# Altium schematic sheet 0056_DISPLAY - EDP MUX .SchDoc (part 1 of 2)
size 848 x 558 mm
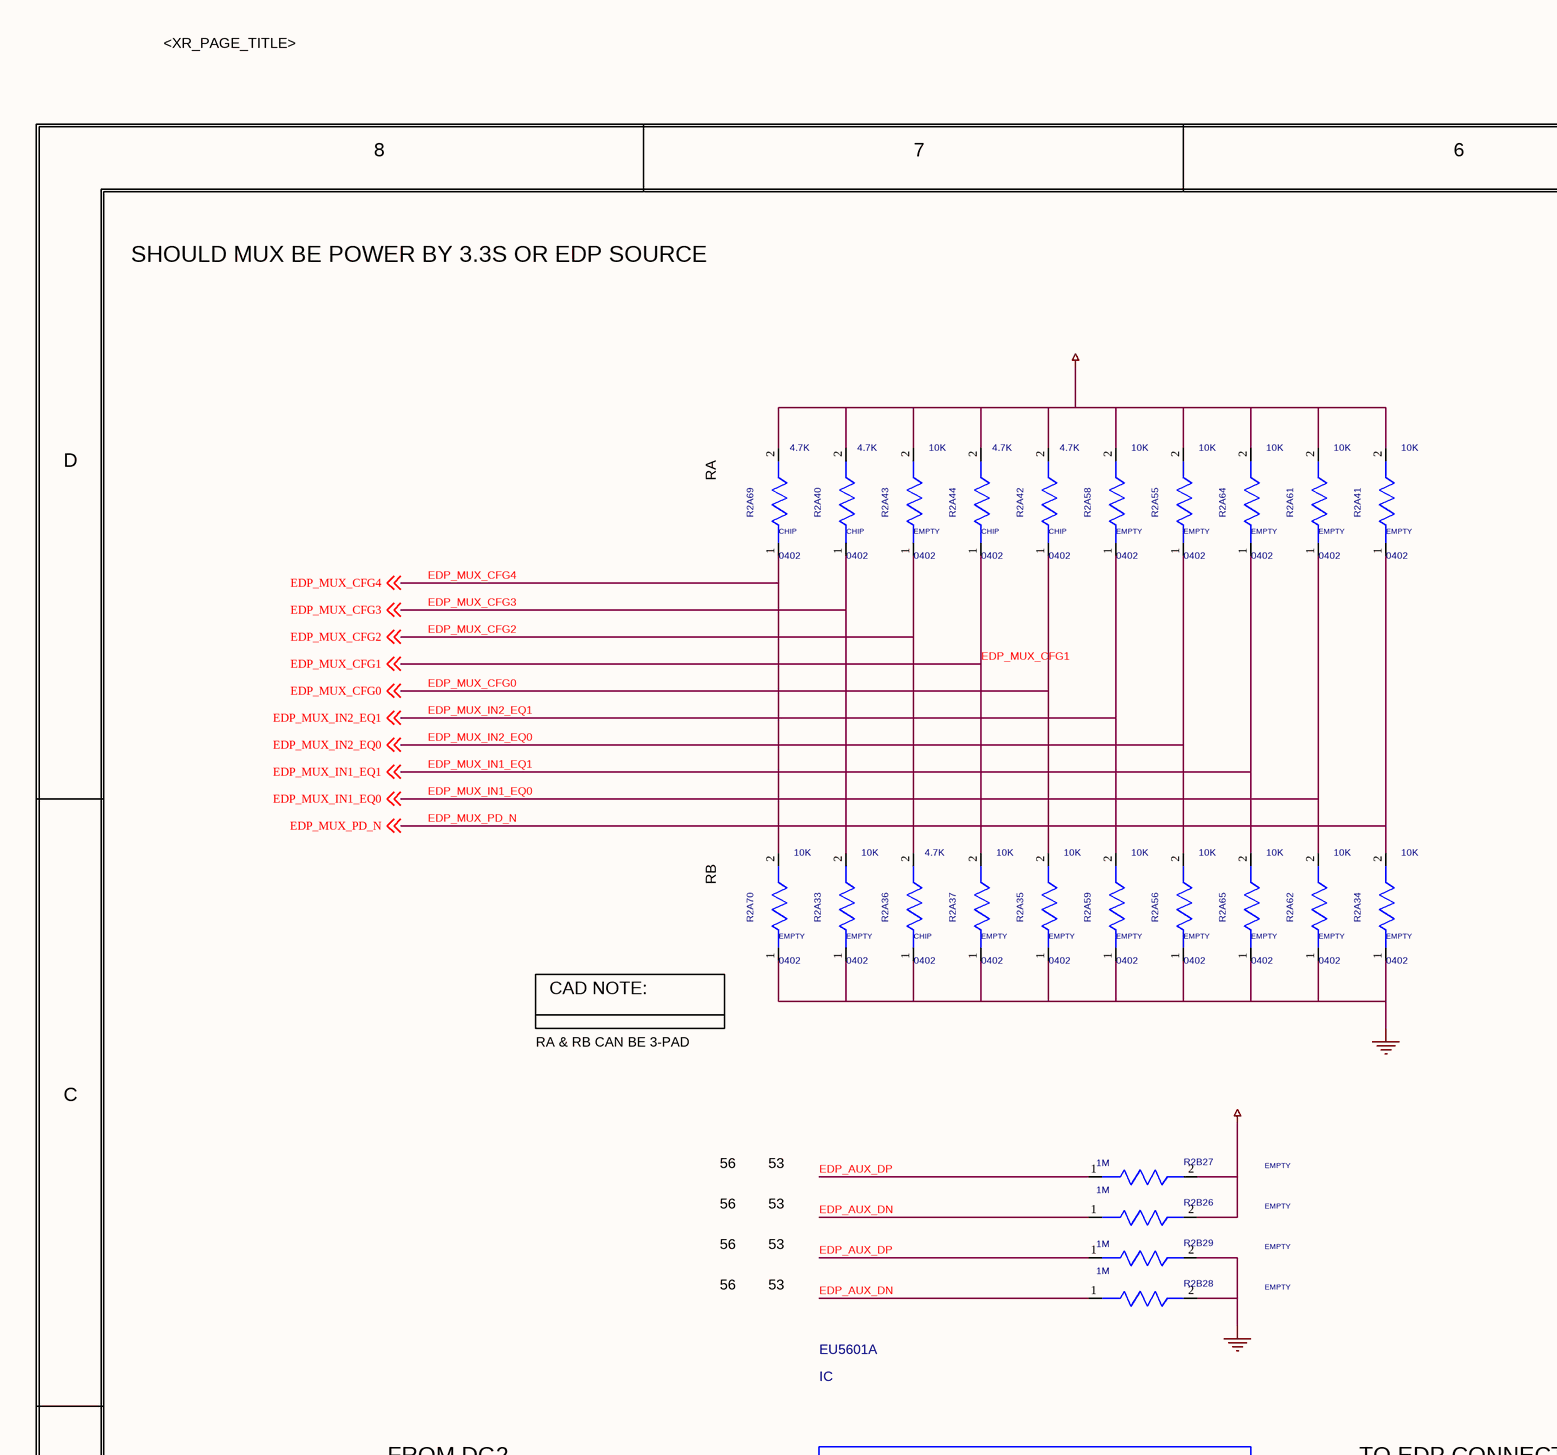
[diagram p0: 0056_DISPLAY - EDP MUX .SchDoc, top left]
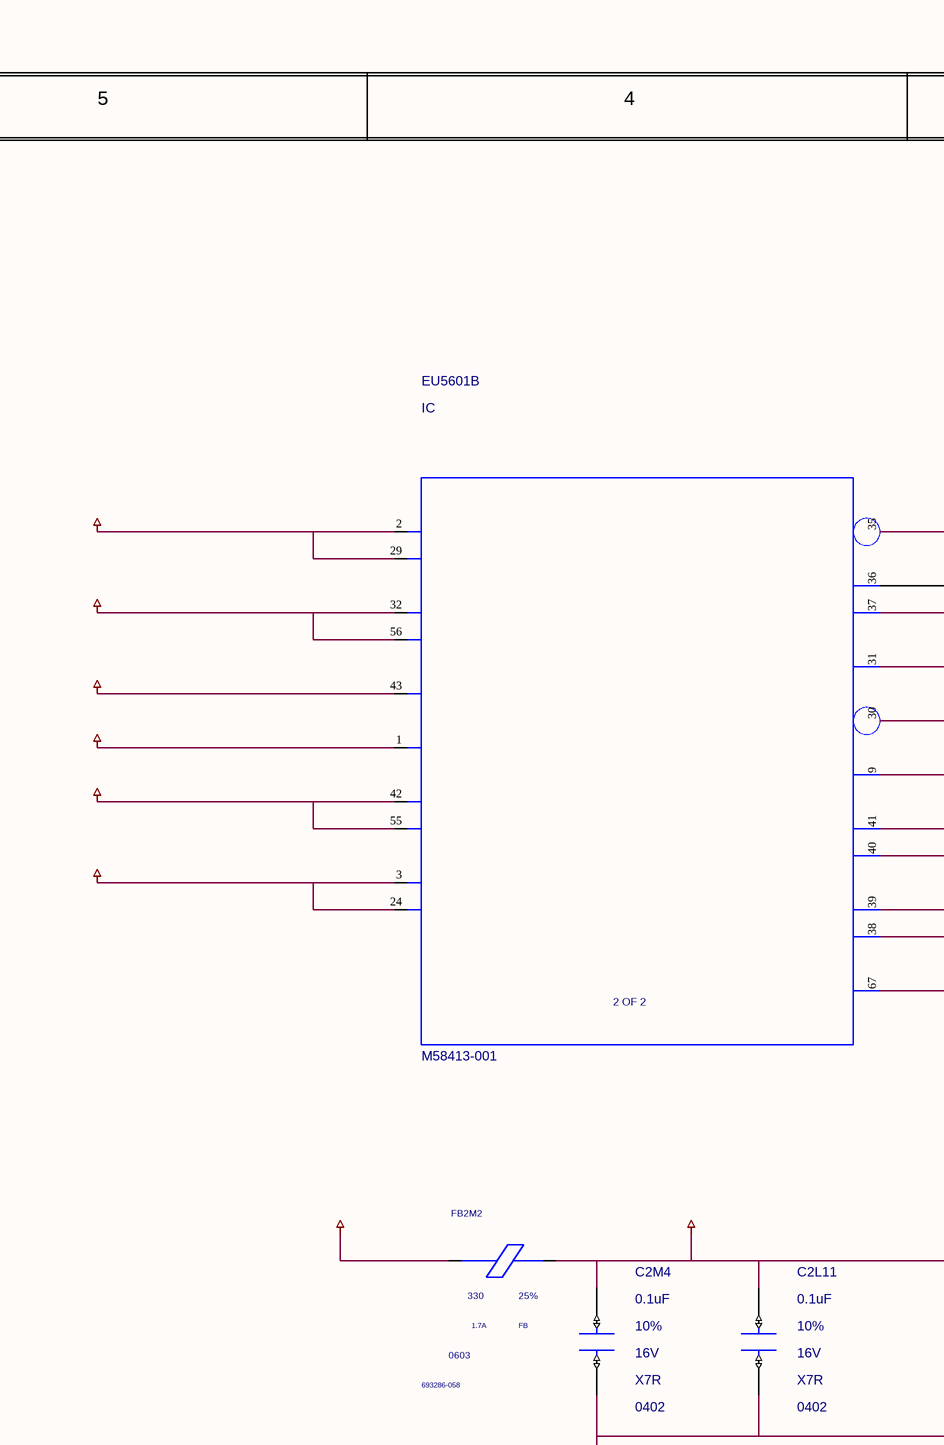
[diagram p1: 0056_DISPLAY - EDP MUX .SchDoc, top middle]
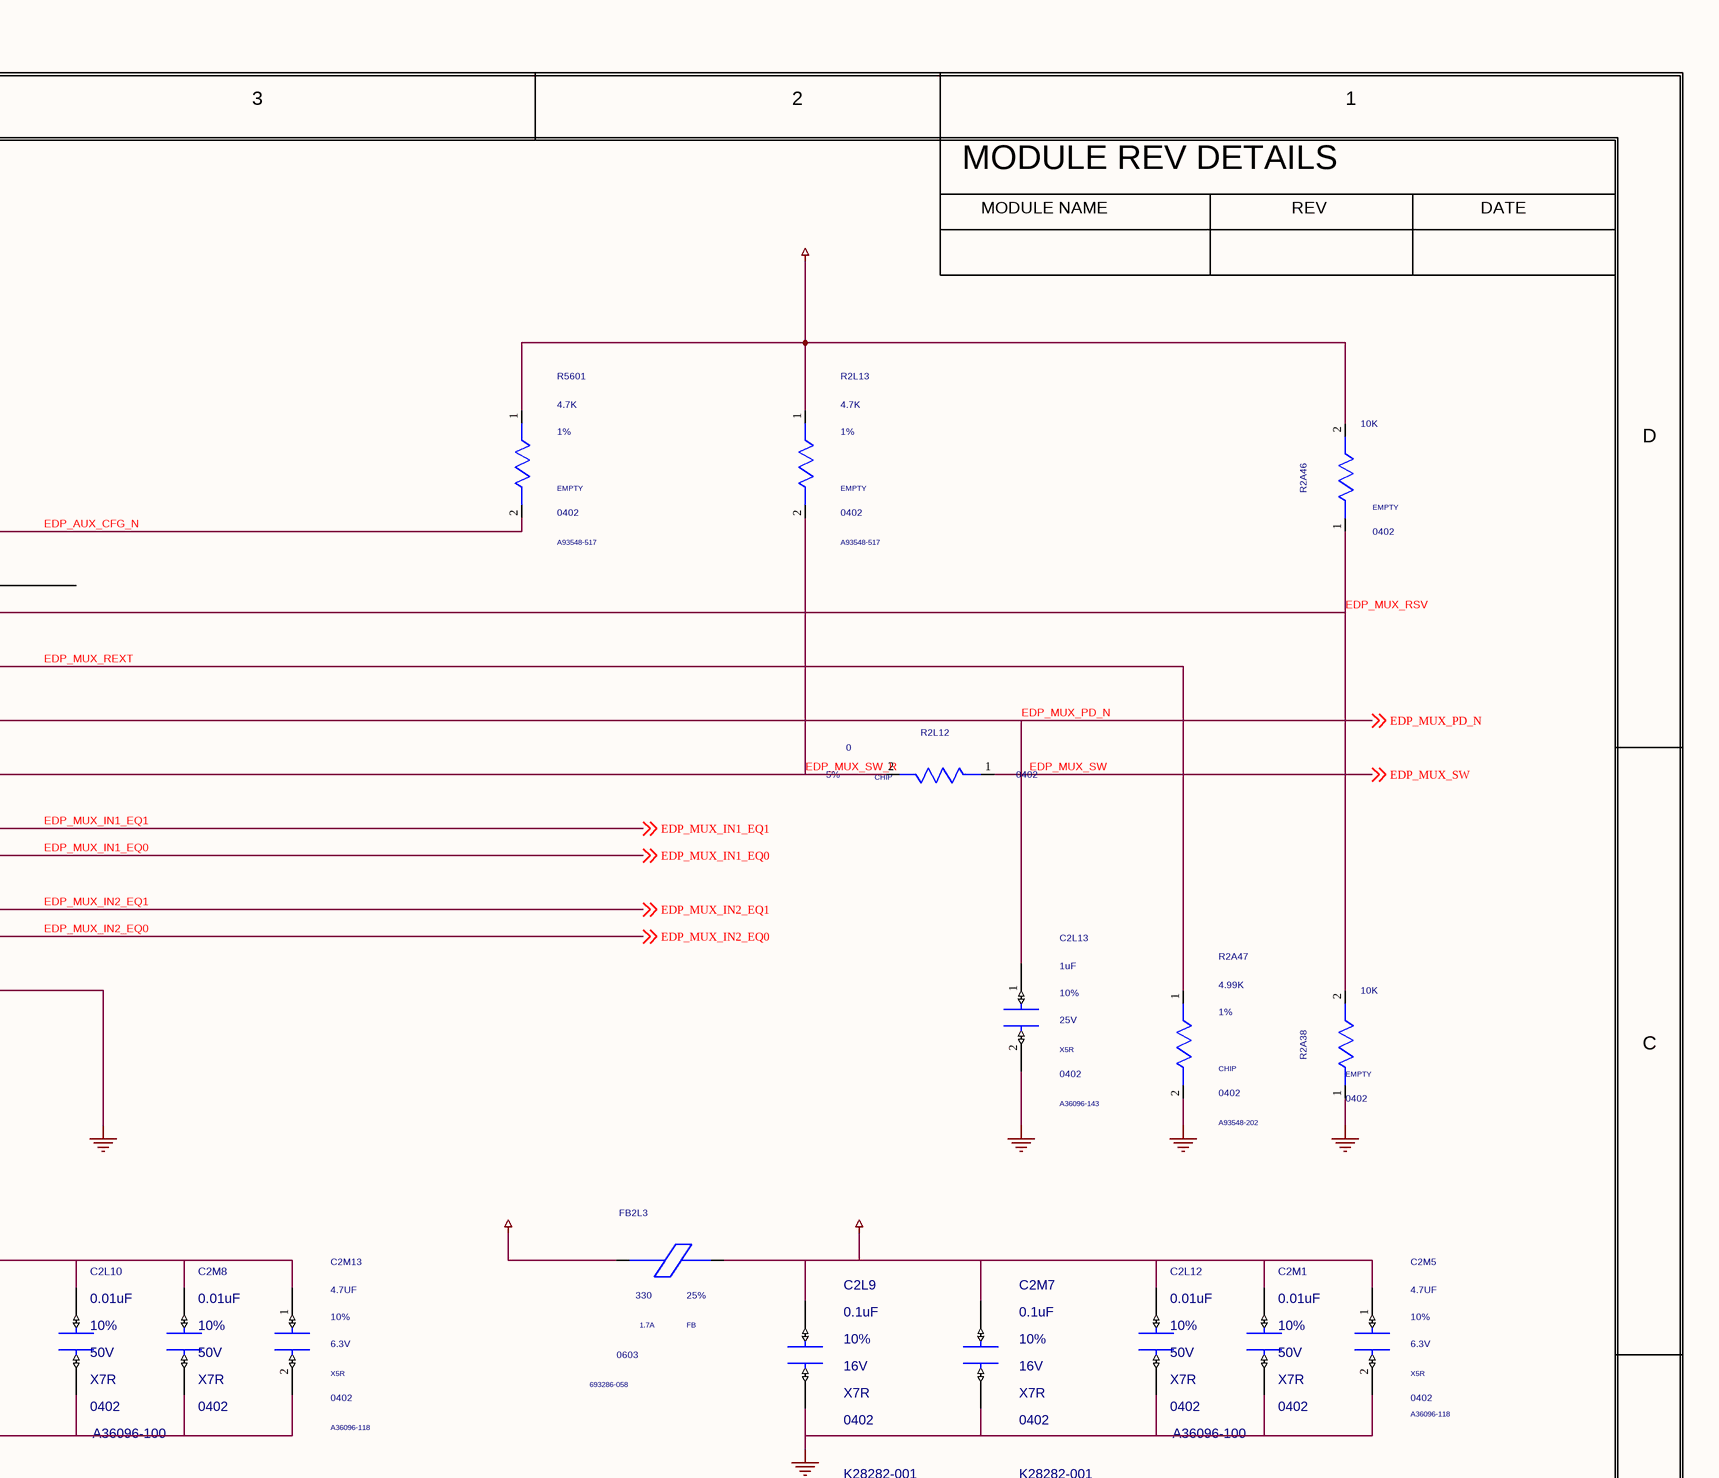
[diagram p2: 0056_DISPLAY - EDP MUX .SchDoc, top right]
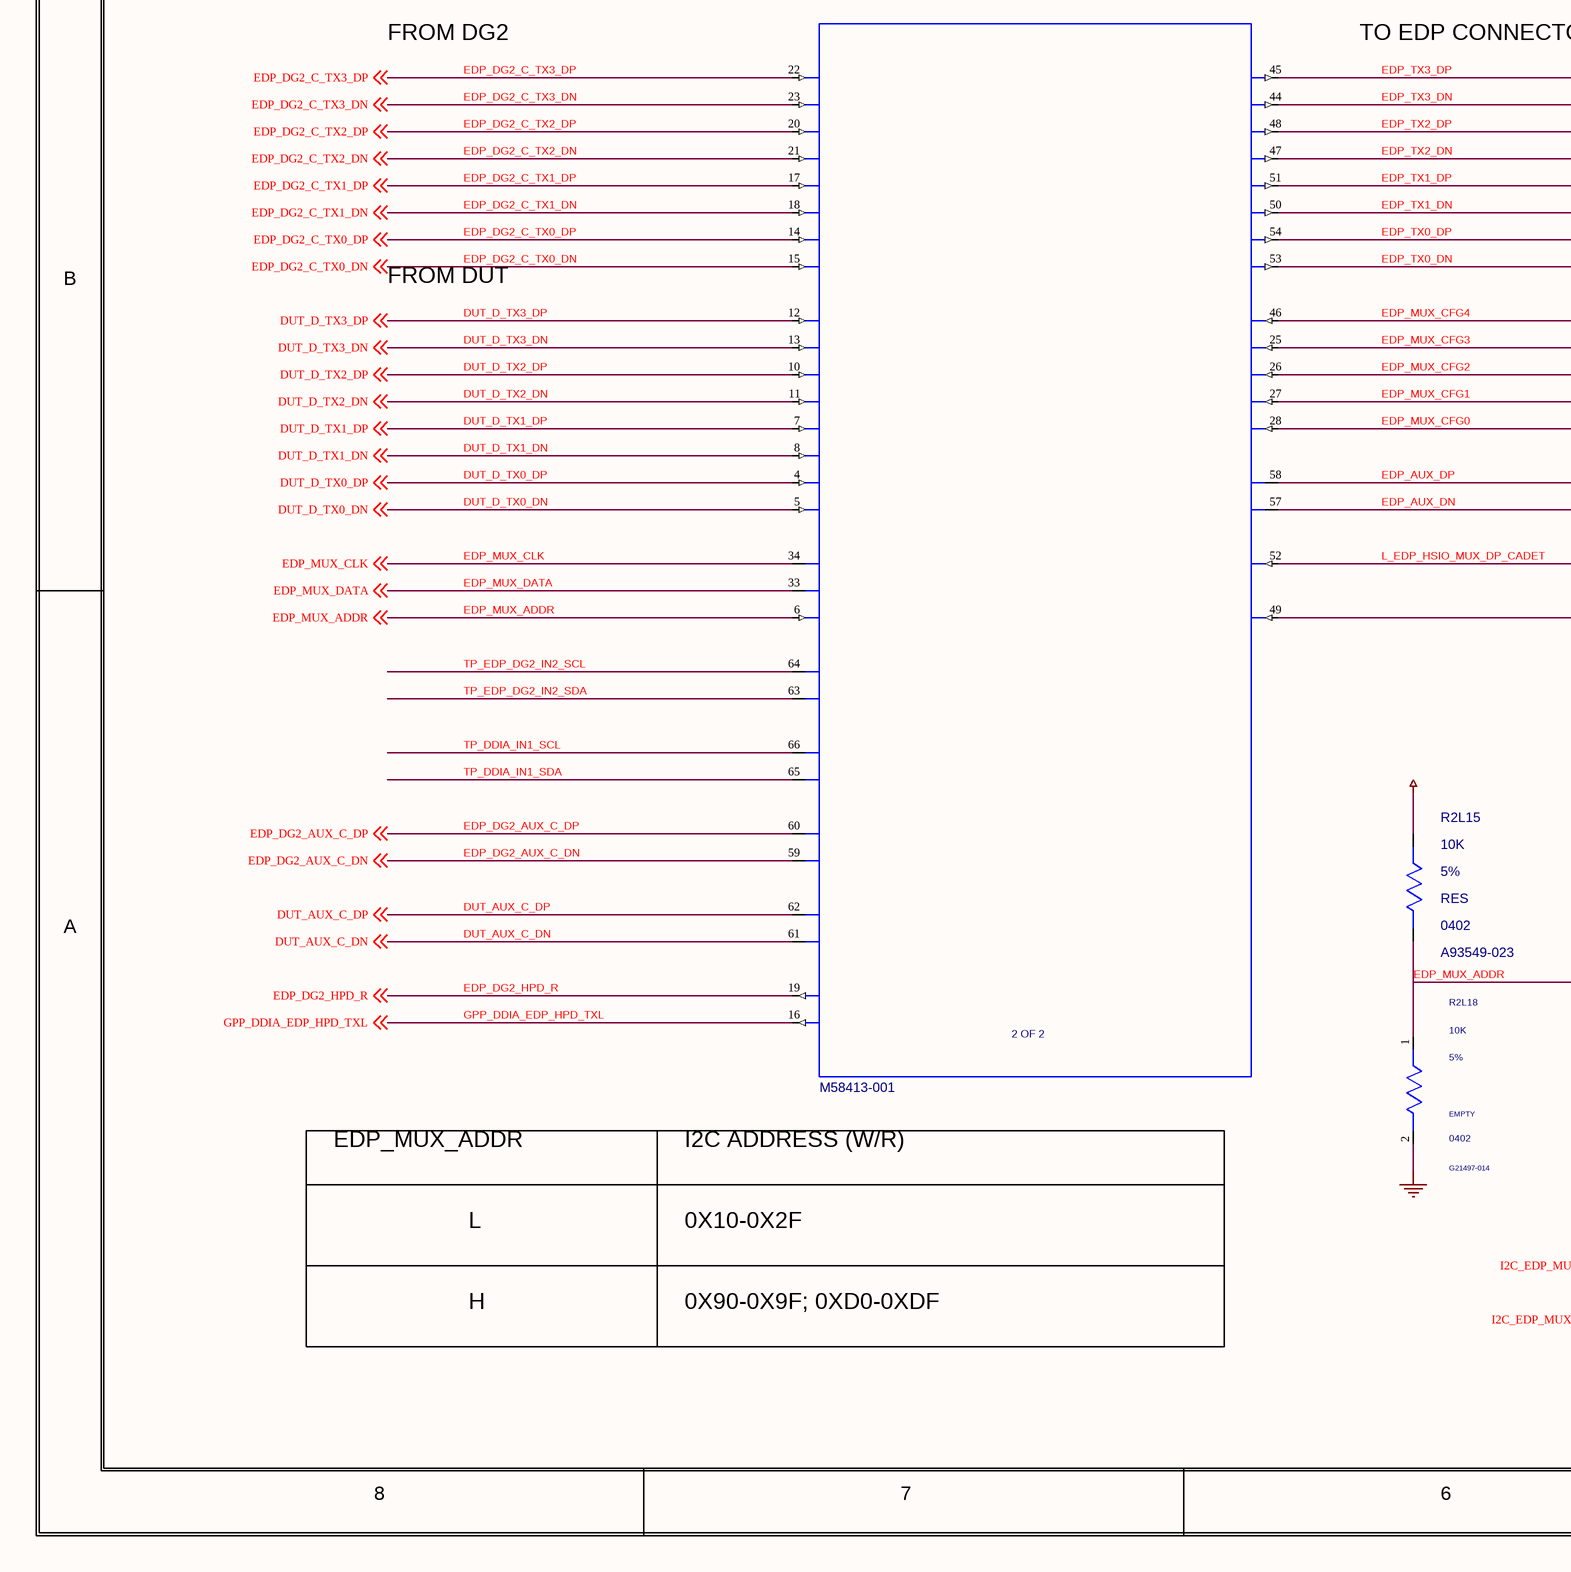
[diagram p3: 0056_DISPLAY - EDP MUX .SchDoc, bottom left]
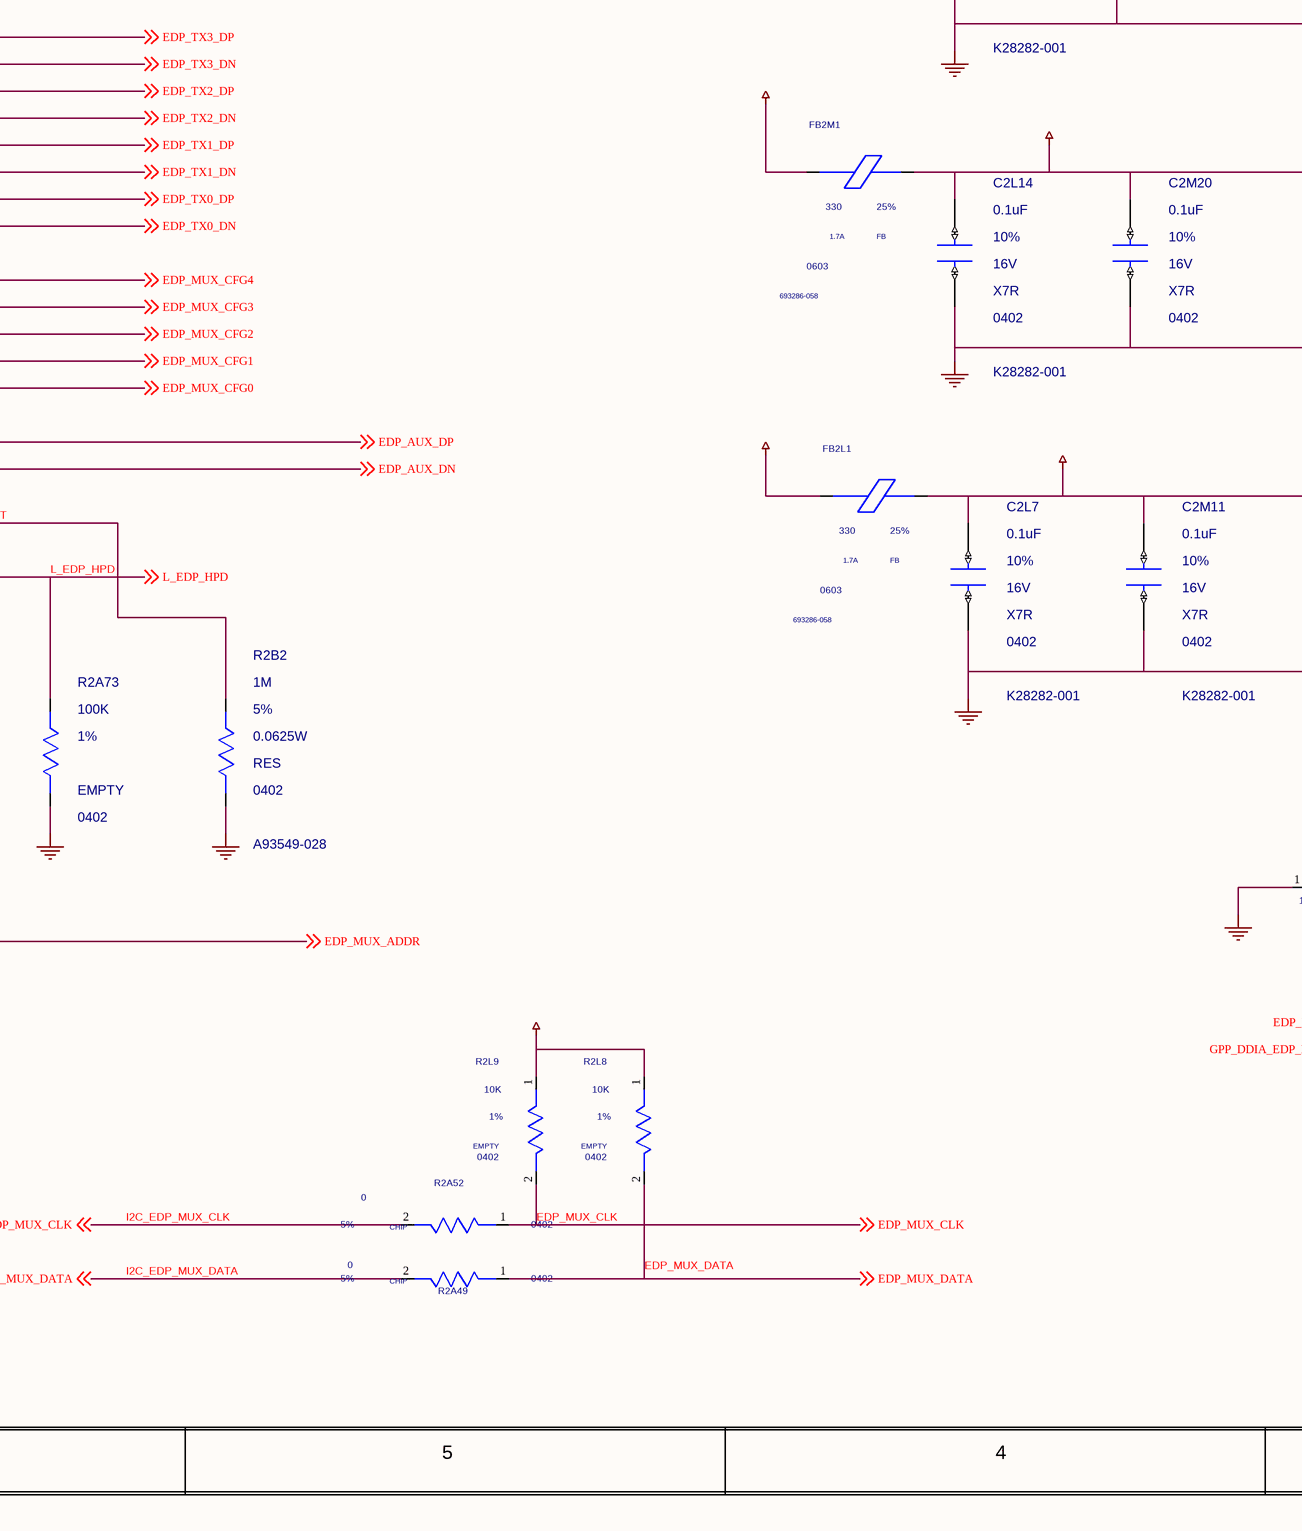
[diagram p4: 0056_DISPLAY - EDP MUX .SchDoc, bottom middle]
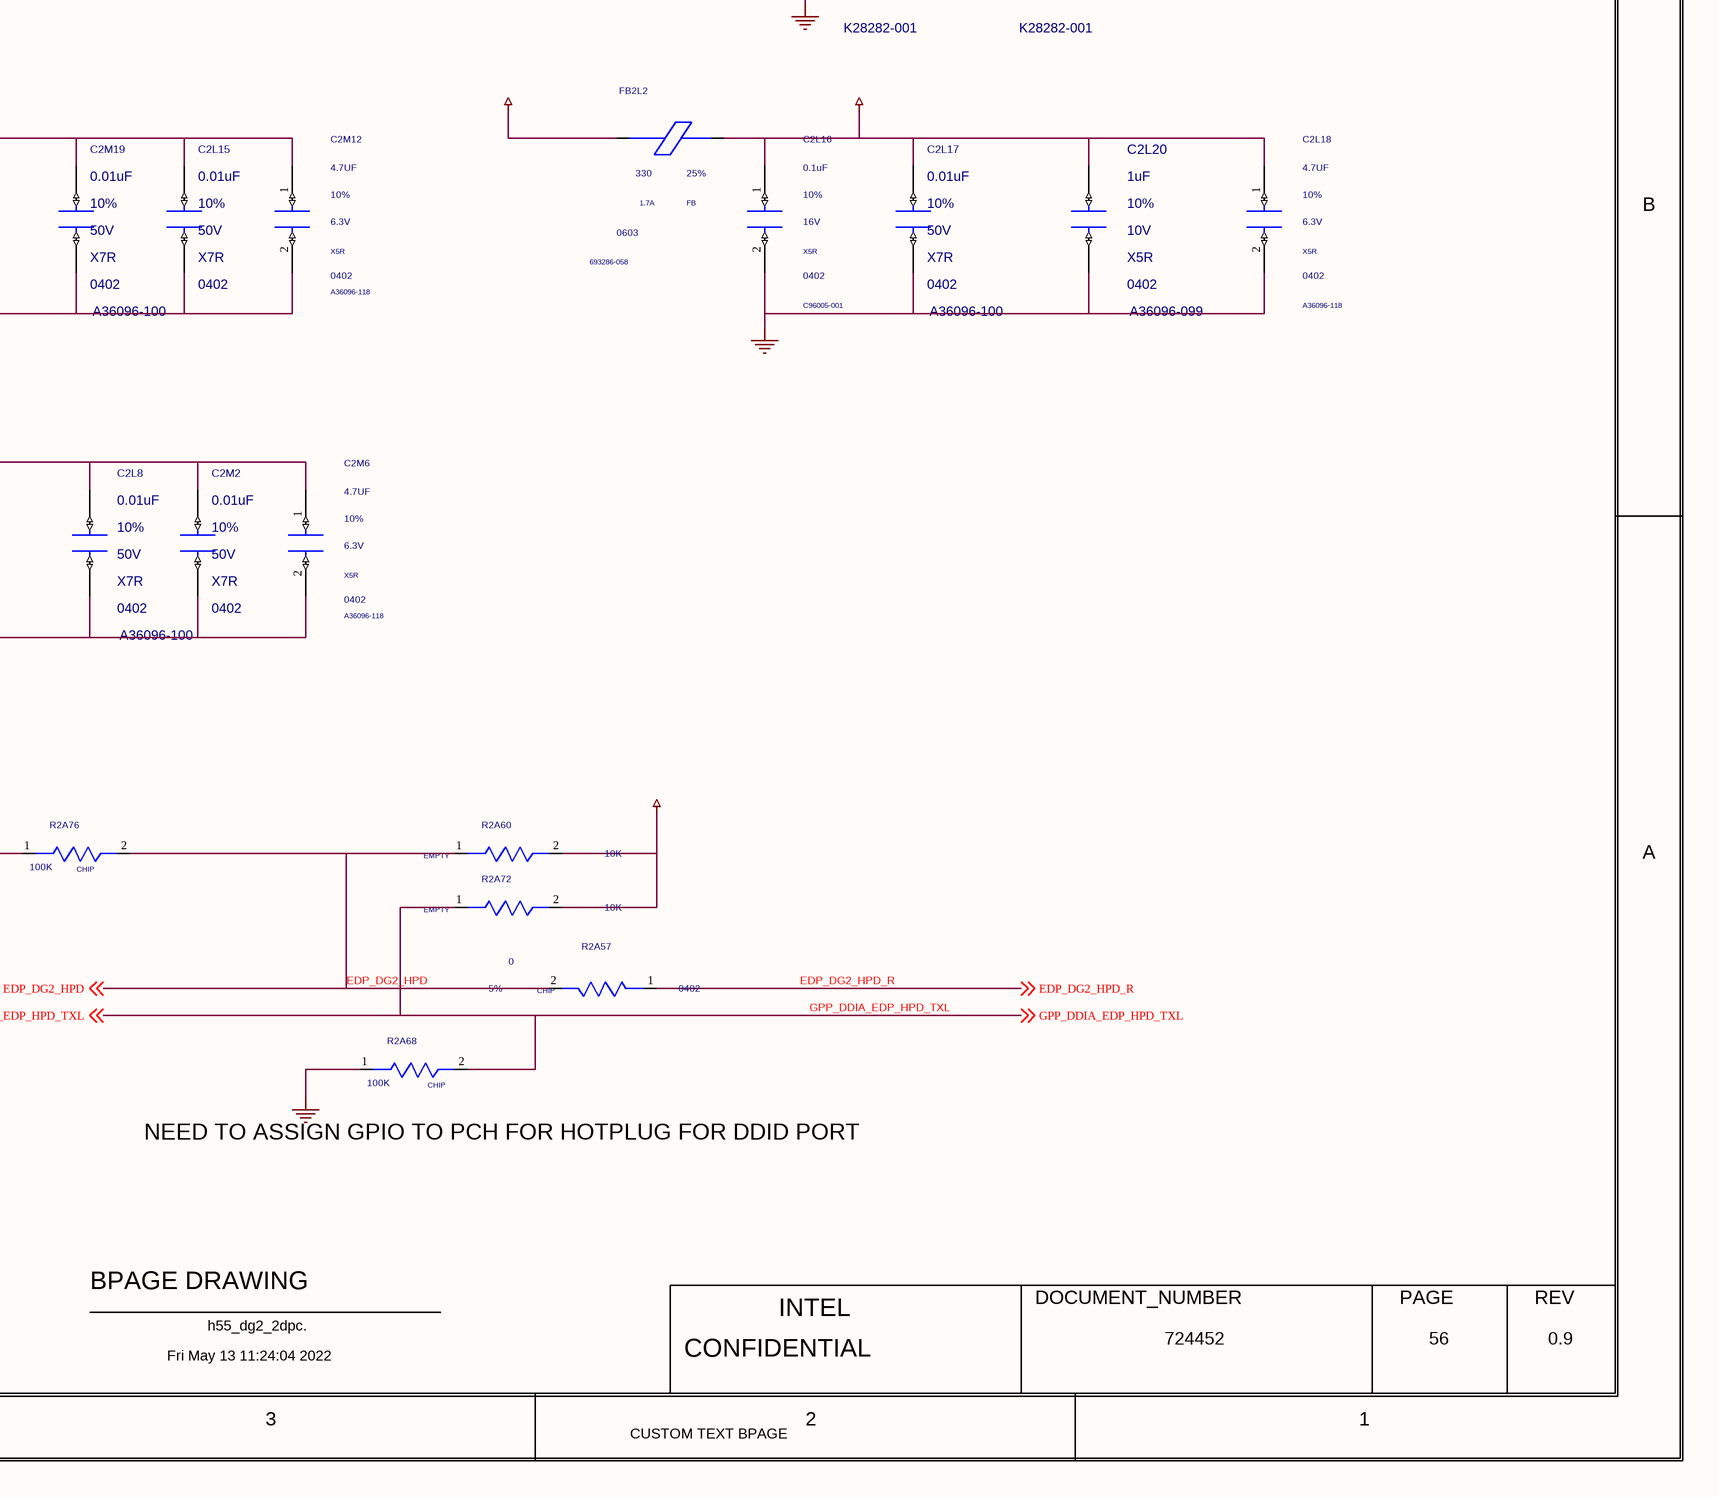
[diagram p5: 0056_DISPLAY - EDP MUX .SchDoc, bottom right]

## Parts
C2L7  0.1uF  MATERIAL: X7R  PACK_TYPE: 0402  PART_NUMBER: K28282-001  TOLERANCE: 10%  VOLTAGE: 16V  [CTK2_SM0402_1050X550_MA]
C2L8  0.01uF  MATERIAL: X7R  PACK_TYPE: 0402  PART_NUMBER: A36096-100  TOLERANCE: 10%  VOLTAGE: 50V  [CTK2_SM0402_1050X550_MA]
C2L9  0.1uF  MATERIAL: X7R  PACK_TYPE: 0402  PART_NUMBER: K28282-001  TOLERANCE: 10%  VOLTAGE: 16V  [CTK2_SM0402_1050X550_MA]
C2L10  0.01uF  MATERIAL: X7R  PACK_TYPE: 0402  PART_NUMBER: A36096-100  TOLERANCE: 10%  VOLTAGE: 50V  [CTK2_SM0402_1050X550_MA]
C2L11  0.1uF  MATERIAL: X7R  PACK_TYPE: 0402  TOLERANCE: 10%  VOLTAGE: 16V  [CTK2_SM0402_1050X550_MA]
C2L12  0.01uF  MATERIAL: X7R  PACK_TYPE: 0402  PART_NUMBER: A36096-100  TOLERANCE: 10%  VOLTAGE: 50V  [CTK2_SM0402_1050X550_MA]
C2L13  1uF  MATERIAL: X5R  PACK_TYPE: 0402  PART_NUMBER: A36096-143  TOLERANCE: 10%  VOLTAGE: 25V  [SMC0402MA]
C2L14  0.1uF  MATERIAL: X7R  PACK_TYPE: 0402  PART_NUMBER: K28282-001  TOLERANCE: 10%  VOLTAGE: 16V  [CTK2_SM0402_1050X550_MA]
C2L15  0.01uF  MATERIAL: X7R  PACK_TYPE: 0402  TOLERANCE: 10%  VOLTAGE: 50V  [CTK2_SM0402_1050X550_MA]
C2L16  0.1uF  MATERIAL: X5R  PACK_TYPE: 0402  PART_NUMBER: C96005-001  TOLERANCE: 10%  VOLTAGE: 16V  [SMC0402IE]
C2L17  0.01uF  MATERIAL: X7R  PACK_TYPE: 0402  PART_NUMBER: A36096-100  TOLERANCE: 10%  VOLTAGE: 50V  [CTK2_SM0402_1050X550_MA]
C2L18  4.7UF  MATERIAL: X5R  PACK_TYPE: 0402  PART_NUMBER: A36096-118  TOLERANCE: 10%  VOLTAGE: 6.3V  [SMC0402MA]
C2L20  1uF  MATERIAL: X5R  PACK_TYPE: 0402  PART_NUMBER: A36096-099  TOLERANCE: 10%  VOLTAGE: 10V  [CTK2_SM0402_1050X550_MA]
C2M1  0.01uF  MATERIAL: X7R  PACK_TYPE: 0402  TOLERANCE: 10%  VOLTAGE: 50V  [CTK2_SM0402_1050X550_MA]
C2M2  0.01uF  MATERIAL: X7R  PACK_TYPE: 0402  TOLERANCE: 10%  VOLTAGE: 50V  [CTK2_SM0402_1050X550_MA]
C2M4  0.1uF  MATERIAL: X7R  PACK_TYPE: 0402  PART_NUMBER: K28282-001  TOLERANCE: 10%  VOLTAGE: 16V  [CTK2_SM0402_1050X550_MA]
C2M5  4.7UF  MATERIAL: X5R  PACK_TYPE: 0402  PART_NUMBER: A36096-118  TOLERANCE: 10%  VOLTAGE: 6.3V  [SMC0402MA]
C2M6  4.7UF  MATERIAL: X5R  PACK_TYPE: 0402  PART_NUMBER: A36096-118  TOLERANCE: 10%  VOLTAGE: 6.3V  [SMC0402MA]
C2M7  0.1uF  MATERIAL: X7R  PACK_TYPE: 0402  PART_NUMBER: K28282-001  TOLERANCE: 10%  VOLTAGE: 16V  [CTK2_SM0402_1050X550_MA]
C2M8  0.01uF  MATERIAL: X7R  PACK_TYPE: 0402  TOLERANCE: 10%  VOLTAGE: 50V  [CTK2_SM0402_1050X550_MA]
C2M11  0.1uF  MATERIAL: X7R  PACK_TYPE: 0402  PART_NUMBER: K28282-001  TOLERANCE: 10%  VOLTAGE: 16V  [CTK2_SM0402_1050X550_MA]
C2M12  4.7UF  MATERIAL: X5R  PACK_TYPE: 0402  PART_NUMBER: A36096-118  TOLERANCE: 10%  VOLTAGE: 6.3V  [SMC0402MA]
C2M13  4.7UF  MATERIAL: X5R  PACK_TYPE: 0402  PART_NUMBER: A36096-118  TOLERANCE: 10%  VOLTAGE: 6.3V  [SMC0402MA]
C2M19  0.01uF  MATERIAL: X7R  PACK_TYPE: 0402  PART_NUMBER: A36096-100  TOLERANCE: 10%  VOLTAGE: 50V  [CTK2_SM0402_1050X550_MA]
C2M20  0.1uF  MATERIAL: X7R  PACK_TYPE: 0402  TOLERANCE: 10%  VOLTAGE: 16V  [CTK2_SM0402_1050X550_MA]
EU5601  MATERIAL: IC  PART_NUMBER: M58413-001  PART_SYM_NUM: 2 OF 2  [CTK2_LCC66_5000X10000_400_DF3600X8600_MA]  (hidden comment: C_PS8461E_A)  (parts A,B of 2)
FB2L1  330  CURRENT: 1.7A  MATERIAL: FB  PACK_TYPE: 0603  PART_NUMBER: 693286-058  TOLERANCE: 25%  [CTK2_SM0603_1750X950_MA]
FB2L2  330  CURRENT: 1.7A  MATERIAL: FB  PACK_TYPE: 0603  PART_NUMBER: 693286-058  TOLERANCE: 25%  [CTK2_SM0603_1750X950_MA]
FB2L3  330  CURRENT: 1.7A  MATERIAL: FB  PACK_TYPE: 0603  PART_NUMBER: 693286-058  TOLERANCE: 25%  [CTK2_SM0603_1750X950_MA]
FB2M1  330  CURRENT: 1.7A  MATERIAL: FB  PACK_TYPE: 0603  PART_NUMBER: 693286-058  TOLERANCE: 25%  [CTK2_SM0603_1750X950_MA]
FB2M2  330  CURRENT: 1.7A  MATERIAL: FB  PACK_TYPE: 0603  PART_NUMBER: 693286-058  TOLERANCE: 25%  [CTK2_SM0603_1750X950_MA]
R2A33  10K  MATERIAL: EMPTY  PACK_TYPE: 0402  [SMR0402IA]
R2A34  10K  MATERIAL: EMPTY  PACK_TYPE: 0402  [SMR0402IA]
R2A35  10K  MATERIAL: EMPTY  PACK_TYPE: 0402  [SMR0402IA]
R2A36  4.7K  MATERIAL: CHIP  PACK_TYPE: 0402  [SMR0402IA]
R2A37  10K  MATERIAL: EMPTY  PACK_TYPE: 0402  [SMR0402IA]
R2A38  10K  MATERIAL: EMPTY  PACK_TYPE: 0402  [SMR0402IA]
R2A40  4.7K  MATERIAL: CHIP  PACK_TYPE: 0402  [SMR0402IA]
R2A41  10K  MATERIAL: EMPTY  PACK_TYPE: 0402  [SMR0402IA]
R2A42  4.7K  MATERIAL: CHIP  PACK_TYPE: 0402  [SMR0402IA]
R2A43  10K  MATERIAL: EMPTY  PACK_TYPE: 0402  [SMR0402IA]
R2A44  4.7K  MATERIAL: CHIP  PACK_TYPE: 0402  [SMR0402IA]
R2A46  10K  MATERIAL: EMPTY  PACK_TYPE: 0402  [SMR0402IA]
R2A47  4.99K  MATERIAL: CHIP  PACK_TYPE: 0402  PART_NUMBER: A93548-202  TOLERANCE: 1%  [SMR0402IA]
R2A49  0  MATERIAL: CHIP  PACK_TYPE: 0402  TOLERANCE: 5%  [SMR0402IA]
R2A52  0  MATERIAL: CHIP  PACK_TYPE: 0402  TOLERANCE: 5%  [SMR0402IA]
R2A55  10K  MATERIAL: EMPTY  PACK_TYPE: 0402  [SMR0402IA]
R2A56  10K  MATERIAL: EMPTY  PACK_TYPE: 0402  [SMR0402IA]
R2A57  0  MATERIAL: CHIP  PACK_TYPE: 0402  TOLERANCE: 5%  [SMR0402IA]
R2A58  10K  MATERIAL: EMPTY  PACK_TYPE: 0402  [SMR0402IA]
R2A59  10K  MATERIAL: EMPTY  PACK_TYPE: 0402  [SMR0402IA]
R2A60  10K  MATERIAL: EMPTY  [SMR0402IA]
R2A61  10K  MATERIAL: EMPTY  PACK_TYPE: 0402  [SMR0402IA]
R2A62  10K  MATERIAL: EMPTY  PACK_TYPE: 0402  [SMR0402IA]
R2A64  10K  MATERIAL: EMPTY  PACK_TYPE: 0402  [SMR0402IA]
R2A65  10K  MATERIAL: EMPTY  PACK_TYPE: 0402  [SMR0402IA]
R2A68  100K  MATERIAL: CHIP  [SMR0402IA]
R2A69  4.7K  MATERIAL: CHIP  PACK_TYPE: 0402  [SMR0402IA]
R2A70  10K  MATERIAL: EMPTY  PACK_TYPE: 0402  [SMR0402IA]
R2A72  10K  MATERIAL: EMPTY  [SMR0402IA]
R2A73  100K  MATERIAL: EMPTY  PACK_TYPE: 0402  TOLERANCE: 1%  [CTK2_SM0402_1100X550_MA]
R2A76  100K  MATERIAL: CHIP  [SMR0402IA]
R2B2  1M  MATERIAL: RES  PACK_TYPE: 0402  PART_NUMBER: A93549-028  TOLERANCE: 5%  WATTAGE: 0.0625W  [CTK2_SM0402_1100X550_MA]
R2B26  1M  MATERIAL: EMPTY  [SMR0201IA]
R2B27  1M  MATERIAL: EMPTY  [SMR0201IA]
R2B28  1M  MATERIAL: EMPTY  [SMR0201IA]
R2B29  1M  MATERIAL: EMPTY  [SMR0201IA]
R2L8  10K  MATERIAL: EMPTY  PACK_TYPE: 0402  TOLERANCE: 1%  [SMR0402IA]
R2L9  10K  MATERIAL: EMPTY  PACK_TYPE: 0402  TOLERANCE: 1%  [SMR0402IA]
R2L12  0  MATERIAL: CHIP  PACK_TYPE: 0402  TOLERANCE: 5%  [SMR0402IA]
R2L13  4.7K  MATERIAL: EMPTY  PACK_TYPE: 0402  PART_NUMBER: A93548-517  TOLERANCE: 1%  [SMR0402IA]
R2L15  10K  MATERIAL: RES  PACK_TYPE: 0402  PART_NUMBER: A93549-023  TOLERANCE: 5%  [CTK2_SM0402_1100X550_MA]
R2L18  10K  MATERIAL: EMPTY  PACK_TYPE: 0402  PART_NUMBER: G21497-014  TOLERANCE: 5%  [SMR0402IA]
R5601  4.7K  MATERIAL: EMPTY  PACK_TYPE: 0402  PART_NUMBER: A93548-517  TOLERANCE: 1%  [SMR0402IA]

## Nets
+V1P2U_DPMUX0: FB2L1.1(A) FB2L2.1(A) FB2L3.1(A) FB2M1.1(A)
+V1P2U_EDP_MUX_VDD12: C2L9.1(A) C2L12.1(A) C2M1.1(A) C2M5.1(A) C2M7.1(A) EU5601.32(VDD12_1) EU5601.56(VDD12_2) FB2L3.2(B)
+V1P2U_EDP_MUX_VDDA12: C2L16.1(A) C2L17.1(A) C2L18.1(A) C2L20.1(A) EU5601.43(VDDA12) FB2L2.2(B)
+V1P2U_EDP_MUX_VDDRX12: C2L7.1(A) C2L8.1(A) C2M2.1(A) C2M6.1(A) C2M11.1(A) EU5601.3(VDDRX12_1) EU5601.24(VDDRX12_2) FB2L1.2(B)
+V1P2U_EDP_MUX_VDDTX12: C2L14.1(A) C2L15.1(A) C2M12.1(A) C2M19.1(A) C2M20.1(A) EU5601.42(VDDTX12_1) EU5601.55(VDDTX12_2) FB2M1.2(B)
+V3P3U_DPMUX0: FB2M2.1(A) R2A40.2(B) R2A41.2(B) R2A42.2(B) R2A43.2(B) R2A44.2(B) R2A55.2(B) R2A58.2(B) R2A60.2(B) R2A61.2(B) R2A64.2(B) R2A69.2(B) R2A72.2(B) R2B26.2(B) R2B27.2(B)
+V3P3U_EDP_MUX_VDD33: C2L10.1(A) C2L11.1(A) C2M4.1(A) C2M8.1(A) C2M13.1(A) EU5601.1(VDD_DDC) EU5601.2(VDD33_1) EU5601.29(VDD33_2) FB2M2.2(B) R2A46.2(B) R2L8.1(A) R2L9.1(A) R2L13.1(A) R2L15.1(A) R5601.1(A)
GND: C2L7.2(B) C2L8.2(B) C2L9.2(B) C2L10.2(B) C2L11.2(B) C2L12.2(B) C2L13.2(B) C2L14.2(B) C2L15.2(B) C2L16.2(B) C2L17.2(B) C2L18.2(B) C2L20.2(B) C2M1.2(B) C2M2.2(B) C2M4.2(B) C2M5.2(B) C2M6.2(B) C2M7.2(B) C2M8.2(B) C2M11.2(B) C2M12.2(B) C2M13.2(B) C2M19.2(B) C2M20.2(B) EU5601.67(THPAD) R2A33.1(A) R2A34.1(A) R2A35.1(A) R2A36.1(A) R2A37.1(A) R2A38.1(A) R2A47.2(B) R2A56.1(A) R2A59.1(A) R2A62.1(A) R2A65.1(A) R2A68.1(A) R2A70.1(A) R2A73.2(B) R2A76.1(A) R2B2.2(B) R2B28.2(B) R2B29.2(B) R2L18.2(B)
DUT_AUX_C_DN: EU5601.61(IN1_AUXN) ; off-sheet DUT_AUX_C_DN
DUT_AUX_C_DP: EU5601.62(IN1_AUXP) ; off-sheet DUT_AUX_C_DP
DUT_D_TX0_DN: EU5601.5(IN1_D0N) ; off-sheet DUT_D_TX0_DN
DUT_D_TX0_DP: EU5601.4(IN1_D0P) ; off-sheet DUT_D_TX0_DP
DUT_D_TX1_DN: EU5601.8(IN1_D1N) ; off-sheet DUT_D_TX1_DN
DUT_D_TX1_DP: EU5601.7(IN1_D1P) ; off-sheet DUT_D_TX1_DP
DUT_D_TX2_DN: EU5601.11(IN1_D2N) ; off-sheet DUT_D_TX2_DN
DUT_D_TX2_DP: EU5601.10(IN1_D2P) ; off-sheet DUT_D_TX2_DP
DUT_D_TX3_DN: EU5601.13(IN1_D3N) ; off-sheet DUT_D_TX3_DN
DUT_D_TX3_DP: EU5601.12(IN1_D3P) ; off-sheet DUT_D_TX3_DP
EDP_AUX_CFG_N: EU5601.35(AUX_CFG_N) R5601.2(B)
EDP_AUX_DN: EU5601.57(DP_AUXN_SDA) R2B26.1(A) R2B28.1(A) ; off-sheet EDP_AUX_DN
EDP_AUX_DP: EU5601.58(DP_AUXP_SCL) R2B27.1(A) R2B29.1(A) ; off-sheet EDP_AUX_DP
EDP_DG2_AUX_C_DN: EU5601.59(IN2_AUXN) ; off-sheet EDP_DG2_AUX_C_DN
EDP_DG2_AUX_C_DP: EU5601.60(IN2_AUXP) ; off-sheet EDP_DG2_AUX_C_DP
EDP_DG2_C_TX0_DN: EU5601.15(IN2_D0N) ; off-sheet EDP_DG2_C_TX0_DN
EDP_DG2_C_TX0_DP: EU5601.14(IN2_D0P) ; off-sheet EDP_DG2_C_TX0_DP
EDP_DG2_C_TX1_DN: EU5601.18(IN2_D1N) ; off-sheet EDP_DG2_C_TX1_DN
EDP_DG2_C_TX1_DP: EU5601.17(IN2_D1P) ; off-sheet EDP_DG2_C_TX1_DP
EDP_DG2_C_TX2_DN: EU5601.21(IN2_D2N) ; off-sheet EDP_DG2_C_TX2_DN
EDP_DG2_C_TX2_DP: EU5601.20(IN2_D2P) ; off-sheet EDP_DG2_C_TX2_DP
EDP_DG2_C_TX3_DN: EU5601.23(IN2_D3N) ; off-sheet EDP_DG2_C_TX3_DN
EDP_DG2_C_TX3_DP: EU5601.22(IN2_D3P) ; off-sheet EDP_DG2_C_TX3_DP
EDP_DG2_HPD: R2A57.2(B) R2A60.1(A) R2A76.2(B) ; off-sheet EDP_DG2_HPD
EDP_DG2_HPD_R: EU5601.19(IN2_HPD) R2A57.1(A) ; off-sheet EDP_DG2_HPD_R
EDP_MUX_ADDR: EU5601.6(I2C_ADDR) R2L15.2(B) R2L18.1(A) ; off-sheet EDP_MUX_ADDR
EDP_MUX_CFG0: EU5601.28(CFG0) R2A35.2(B) R2A42.1(A) ; off-sheet EDP_MUX_CFG0
EDP_MUX_CFG1: EU5601.27(CFG1) R2A37.2(B) R2A44.1(A) ; off-sheet EDP_MUX_CFG1
EDP_MUX_CFG2: EU5601.26(CFG2) R2A36.2(B) R2A43.1(A) ; off-sheet EDP_MUX_CFG2
EDP_MUX_CFG3: EU5601.25(CFG3) R2A33.2(B) R2A40.1(A) ; off-sheet EDP_MUX_CFG3
EDP_MUX_CFG4: EU5601.46(CFG4) R2A69.1(A) R2A70.2(B) ; off-sheet EDP_MUX_CFG4
EDP_MUX_CLK: EU5601.34(CSCL) R2A52.1(A) R2L9.2(B) ; off-sheet EDP_MUX_CLK
EDP_MUX_DATA: EU5601.33(CSDA) R2A49.1(A) R2L8.2(B) ; off-sheet EDP_MUX_DATA
EDP_MUX_IN1_EQ0: EU5601.40(IN1_EQ0) R2A61.1(A) R2A62.2(B) ; off-sheet EDP_MUX_IN1_EQ0
EDP_MUX_IN1_EQ1: EU5601.41(IN1_EQ1) R2A64.1(A) R2A65.2(B) ; off-sheet EDP_MUX_IN1_EQ1
EDP_MUX_IN2_EQ0: EU5601.38(IN2_EQ0) R2A55.1(A) R2A56.2(B) ; off-sheet EDP_MUX_IN2_EQ0
EDP_MUX_IN2_EQ1: EU5601.39(IN2_EQ1) R2A58.1(A) R2A59.2(B) ; off-sheet EDP_MUX_IN2_EQ1
EDP_MUX_PD_N: C2L13.1(A) EU5601.30(PD_N) R2A34.2(B) R2A41.1(A) ; off-sheet EDP_MUX_PD_N
EDP_MUX_REXT: EU5601.31(REXT) R2A47.1(A)
EDP_MUX_RSV: EU5601.37(RSV0) R2A38.2(B) R2A46.1(A)
EDP_MUX_SW: R2L12.1(A) ; off-sheet EDP_MUX_SW
EDP_MUX_SW_R: EU5601.9(SW) R2L12.2(B) R2L13.2(B)
EDP_TX0_DN: EU5601.53(OUT_D0N) ; off-sheet EDP_TX0_DN
EDP_TX0_DP: EU5601.54(OUT_D0P) ; off-sheet EDP_TX0_DP
EDP_TX1_DN: EU5601.50(OUT_D1N) ; off-sheet EDP_TX1_DN
EDP_TX1_DP: EU5601.51(OUT_D1P) ; off-sheet EDP_TX1_DP
EDP_TX2_DN: EU5601.47(OUT_D2N) ; off-sheet EDP_TX2_DN
EDP_TX2_DP: EU5601.48(OUT_D2P) ; off-sheet EDP_TX2_DP
EDP_TX3_DN: EU5601.44(OUT_D3N) ; off-sheet EDP_TX3_DN
EDP_TX3_DP: EU5601.45(OUT_D3P) ; off-sheet EDP_TX3_DP
GPP_DDIA_EDP_HPD_TXL: EU5601.16(IN1_HPD) R2A68.2(B) R2A72.1(A) ; off-sheet GPP_DDIA_EDP_HPD_TXL
I2C_EDP_MUX_CLK: R2A52.2(B) ; off-sheet I2C_EDP_MUX_CLK
I2C_EDP_MUX_DATA: R2A49.2(B) ; off-sheet I2C_EDP_MUX_DATA
L_EDP_HPD: EU5601.49(OUT_HPD) R2A73.1(A) ; off-sheet L_EDP_HPD
L_EDP_HSIO_MUX_DP_CADET: EU5601.52(DP_CADET) R2B2.1(A)
TP_DDIA_IN1_SCL: EU5601.66(IN1_SCL)
TP_DDIA_IN1_SDA: EU5601.65(IN1_SDA)
TP_EDP_DG2_IN2_SCL: EU5601.64(IN2_SCL)
TP_EDP_DG2_IN2_SDA: EU5601.63(IN2_SDA)

Not connected (* = marked no-connect by the designer): EU5601 36(RSV1)

## Notes on the sheet
- <XR_PAGE_TITLE>
- 8
- 7
- 6
- 5
- 4
- 3
- 2
- 1
- MODULE REV DETAILS
- SHOULD MUX BE POWER BY 3.3S OR EDP SOURCE
- MODULE NAME
- REV
- DATE
- D
- RA
- RB
- CAD NOTE:
- RA & RB CAN BE 3-PAD
- C
- 56
- 53
- FROM DG2
- TO EDP CONNECTOR
- B
- FROM DUT
- A
- EDP_MUX_ADDR
- I2C ADDRESS (W/R)
- L
- 0X10-0X2F
- (near R2A68) NEED TO ASSIGN GPIO TO PCH FOR HOTPLUG FOR DDID PORT
- H
- 0X90-0X9F; 0XD0-0XDF
- BPAGE DRAWING
- INTEL
- DOCUMENT_NUMBER
- PAGE
- Fri May 13 11:24:04 2022
- h55_dg2_2dpc.
- CONFIDENTIAL
- 724452
- 0.9
- CUSTOM TEXT BPAGE